# EAGLE design 0134-logic-level-shifter-x8 (EAGLE 9.6.2)
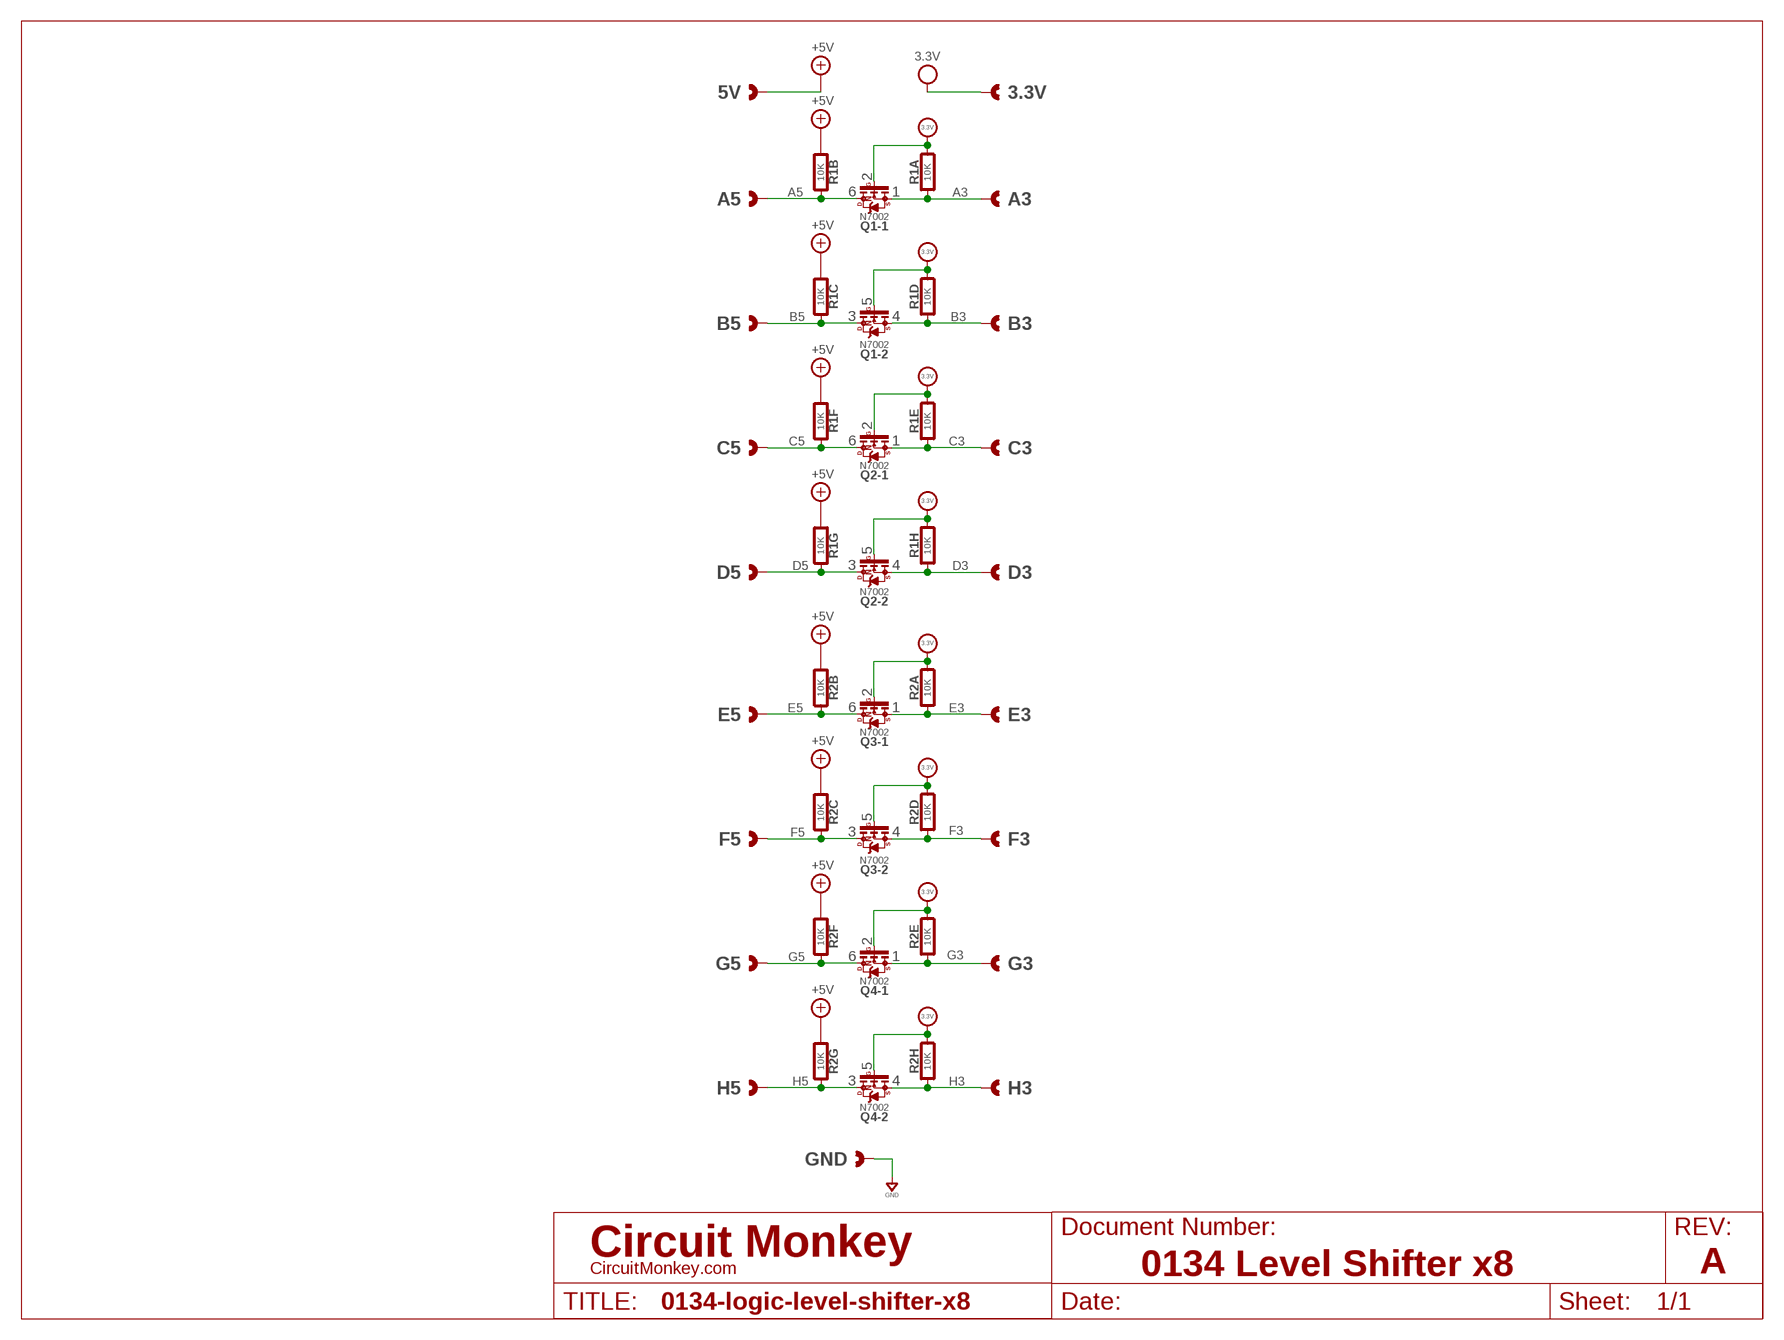
[diagram p0: schematic, sheet 1]
U$1 (LETTER_L-CIRCUITMONKEY): DOCUMENT_NUMBER: 0134 Level Shifter x8; REV: A

## Parts
3.3V  CAST-01X12.00MM  [CAST01-2.00MM]
5V  CAST-01X12.00MM  [CAST01-2.00MM]
A3  CAST-01X12.00MM  [CAST01-2.00MM]
A5  CAST-01X12.00MM  [CAST01-2.00MM]
B3  CAST-01X12.00MM  [CAST01-2.00MM]
B5  CAST-01X12.00MM  [CAST01-2.00MM]
C3  CAST-01X12.00MM  [CAST01-2.00MM]
C5  CAST-01X12.00MM  [CAST01-2.00MM]
D3  CAST-01X12.00MM  [CAST01-2.00MM]
D5  CAST-01X12.00MM  [CAST01-2.00MM]
E3  CAST-01X12.00MM  [CAST01-2.00MM]
E5  CAST-01X12.00MM  [CAST01-2.00MM]
F3  CAST-01X12.00MM  [CAST01-2.00MM]
F5  CAST-01X12.00MM  [CAST01-2.00MM]
G3  CAST-01X12.00MM  [CAST01-2.00MM]
G5  CAST-01X12.00MM  [CAST01-2.00MM]
GND  CAST-01X12.00MM  [CAST01-2.00MM]
H3  CAST-01X12.00MM  [CAST01-2.00MM]
H5  CAST-01X12.00MM  [CAST01-2.00MM]
Q1  N7002  N-FET_DUAL7002  [SOT-563]
Q2  N7002  N-FET_DUAL7002  [SOT-563]
Q3  N7002  N-FET_DUAL7002  [SOT-563]
Q4  N7002  N-FET_DUAL7002  [SOT-563]
R1  10K  RESNET_0402_INDIV_X8PAN  [RESNET_0402_X8]
R2  10K  RESNET_0402_INDIV_X8PAN  [RESNET_0402_X8]

## Nets
+3.3V: 3.3V.1 3.3V.P$1 3.3V.P$2 Q1.2(-1:G) Q1.5(-2:G) Q2.2(-1:G) Q2.5(-2:G) Q3.2(-1:G) Q3.5(-2:G) Q4.2(-1:G) Q4.5(-2:G) R1.1 R1.4 R1.5 R1.8 R2.1 R2.4 R2.5 R2.8 ; supply symbol labelled 3.3V
+5V: 5V.1 5V.P$1 5V.P$2 R1.10 R1.11 R1.14 R1.15 R2.10 R2.11 R2.14 R2.15
A3: A3.1 A3.P$1 A3.P$2 Q1.1(-1:S) R1.16
A5: A5.1 A5.P$1 A5.P$2 Q1.6(-1:D) R1.2
B3: B3.1 B3.P$1 B3.P$2 Q1.4(-2:S) R1.13
B5: B5.1 B5.P$1 B5.P$2 Q1.3(-2:D) R1.3
C3: C3.1 C3.P$1 C3.P$2 Q2.1(-1:S) R1.12
C5: C5.1 C5.P$1 C5.P$2 Q2.6(-1:D) R1.6
D3: D3.1 D3.P$1 D3.P$2 Q2.4(-2:S) R1.9
D5: D5.1 D5.P$1 D5.P$2 Q2.3(-2:D) R1.7
E3: E3.1 E3.P$1 E3.P$2 Q3.1(-1:S) R2.16
E5: E5.1 E5.P$1 E5.P$2 Q3.6(-1:D) R2.2
F3: F3.1 F3.P$1 F3.P$2 Q3.4(-2:S) R2.13
F5: F5.1 F5.P$1 F5.P$2 Q3.3(-2:D) R2.3
G3: G3.1 G3.P$1 G3.P$2 Q4.1(-1:S) R2.12
G5: G5.1 G5.P$1 G5.P$2 Q4.6(-1:D) R2.6
GND: GND.1 GND.P$1 GND.P$2
H3: H3.1 H3.P$1 H3.P$2 Q4.4(-2:S) R2.9
H5: H5.1 H5.P$1 H5.P$2 Q4.3(-2:D) R2.7

## Library data of the parts
3.3V 5V A3 A5 B3 B5 C3 C5 D3 D5 E3 E5 F3 F5 G3 G5 GND H3 H5 = con-headers:CAST-01X1: Castelated Edge Hole Pad
Q1-Q4 = transistor-fet:N-FET_DUAL: Dual FET; COST01: 0.25; COST100: 0.07; MFR: Toshiba; MPN: SSM6N7002BFE
R1 R2 = rlc:RESNET_0402_INDIV_X8: Resnet - Network Eight Individual Resistors.; COST01: 0.27; COST10: 0.17; COST100: 0.10; MFR: Panasonic; MPN: EXB-2HVxxx

## Board
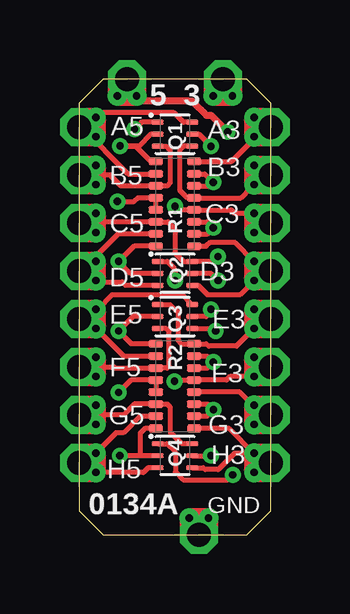
[diagram p1: board, top side]
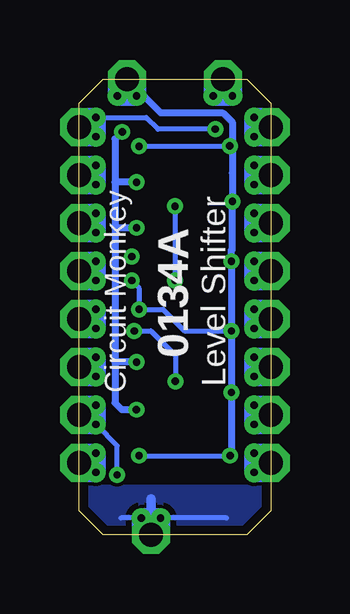
[diagram p2: board, bottom side, seen from below]

Size 8 x 19 mm. Coordinates in mm from the lower left corner, seen from the top.
Outline: 0,18 0,1 1,0 7,0 8,1 8,18 7,19 1,19 0,18
Copper layers (1*16): Top 0.0712mm / dielectric 0.657mm / Bottom 0.0712mm
Design rules "OSH-CircuitMonkey-thin": minimum track width 6mil, minimum drill 12mil, track to track 6mil, track to pad 6mil, pad to pad 6mil, via to via 6mil, smd to smd 6mil, copper to edge 15mil, drill to drill 6mil, minimum pad ring 7mil, minimum via ring 7mil, stop-mask expansion 3mil, vias tented up to drill 14mil, thermal gap 10mil

### Footprints (pad centres in the part's own frame; a part is rotated, then mirrored left to right if it is on the bottom)
CAST01-2.00MM = drill 1 pad 1.6 octagon: 1 0,0 | drill 0.305 pad 0.813: P$1 -0.7,0.4; P$2 -0.7,-0.4
SOT-563 = smd 0.2 x 0.5: 1 -0.5,-0.72; 2 0,-0.72; 3 0.5,-0.72; 4 0.5,0.72; 5 0,0.72; 6 -0.5,0.72
RESNET_0402_X8 = smd 0.6 x 0.325: 1 -0.8,1.765; 8 -0.8,-1.765; 9 0.8,-1.765; 16 0.8,1.765 | smd 0.6 x 0.3: 2 -0.8,1.25; 3 -0.8,0.75; 4 -0.8,0.25; 5 -0.8,-0.25; 6 -0.8,-0.75; 7 -0.8,-1.25; 10 0.8,-1.25; 11 0.8,-0.75; 12 0.8,-0.25; 13 0.8,0.25; 14 0.8,0.75; 15 0.8,1.25

### Placement (x,y rotation side)
3.3V  6,19 90 top
5V  2,19 90 top
A3  8,17 0 top
A5  0,17 180 top
B3  8,15 0 top
B5  0,15 180 top
C3  8,13 0 top
C5  0,13 180 top
D3  8,11 0 top
D5  0,11 180 top
E3  8,9 0 top
E5  0,9 180 top
F3  8,7 0 top
F5  0,7 180 top
G3  8,5 0 top
G5  0,5 180 top
GND  5,0 270 top
H3  8,3 0 top
H5  0,3 180 top
Q1  4,16.7 270 top
Q2  4,10.9 270 top
Q3  4,9.1 270 top
Q4  4,3.3 270 top
R1  4,13.8 0 top
R2  4,6.2 0 top

### Tracks (layer width: path | path; a pad name or v marks a point on that pad's centre or on a via)
+3.3V  (via drill 0.3)
  Top 0.2: Q1.2 2.98,16.7 2.49,16.21 v1.71,16.21 2.35,16.21 3,15.56 R1.1 | v1.6,13.9 2.3,13.9 2.45,14.05 R1.4 R1.5 | R2.5 R2.4 2.17,6.45 v1.65,5.93 | R1.8 2.3,12.04 1.67,11.41 v1.65,11.41 2.15,10.9 Q2.2 | Q4.5 v5.5,3.3 | v5.5,9.4 5.5,9.3 5.3,9.1 Q3.5 | Q2.5 5.5,10.9 v5.8,10.6 | v5.5,16.2 5,16.7 Q1.5 | Q4.2 2.55,3.3 | 2.55,3.3 v1.7,3.3 | R2.8 2.75,4.43 2.55,4.24 2.55,3.3 | R2.1 2.18,7.96 v1.65,8.5 2.25,9.1 Q3.2 | 3.3V.P$1 5.6,18.6 3.3V.1 6,18.7 3.3V.P$2
  Bottom 0.2: v5.5,3.3 v1.7,3.3 | v1.65,8.5 3.6,8.5 4.5,9.4 v5.5,9.4 5.5,10.3 v5.8,10.6 | v5.5,16.2 5.49,16.21 v1.71,16.21
  Bottom 0.3: v1.7,3.3 1.65,3.35 v1.65,5.93 v1.65,8.5 v1.65,11.41 1.65,11.86 1.61,11.89 1.61,13.89 v1.6,13.9 1.61,13.9 1.61,15.1 1.61,16.11 v1.71,16.21 1.61,16.31 1.61,17.21 2,17.6 4.6,17.6 3.3V.1
+5V  (via drill 0.3)
  Top 0.2: R2.15 5.35,7.45 v5.6,7.2 5.35,6.95 R2.14 | R2.11 5.38,5.45 v5.61,5.22 5.34,4.95 R2.10 | R1.10 5.35,12.55 v5.6,12.8 5.35,13.05 R1.11 | R1.14 5.45,14.55 v5.6,14.7 5.25,15.05 R1.15 | 5V.P$2 2.4,18.6 5V.1 1.6,18.6 5V.P$1
  Top 0.3: 5V.1 2,18.8 2.7,18.1 4.7,18.1 5.31,17.49 5.51,17.49 v6.2,16.8
  Bottom 0.3: v5.61,5.22 6.22,5.22 6.5,5.5 6.5,7.2 | v6.2,16.8 6.5,16.5 6.5,14.7 | 6.5,14.7 6.5,12.8 | 6.5,12.8 6.5,7.2 | v5.6,7.2 6.5,7.2 | v5.6,14.7 6.5,14.7 | v5.6,12.8 6.5,12.8
A3  (via drill 0.3)
  Top 0.2: R1.16 6.37,15.56 7.3,16.5 A3.P$2 | A3.P$2 7.7,17 A3.1 | Q1.1 2.6,17.2 v2.32,16.91 | A3.1 7.6,17.4 A3.P$1 | A3.1 7.6,16.6 A3.P$2
  Bottom 0.2: A3.1 7.7,17 A3.P$1 5.2,17.4 4.71,16.91 v2.32,16.91
A5
  Top 0.2: R1.2 2.05,15.05 0.1,17 A5.1 | Q1.6 4.36,17.2 3.96,17.6 0.6,17.6 A5.1 | A5.1 0.3,17 A5.P$1 | A5.1 0.4,17.4 A5.P$2
B3
  Top 0.2: B3.P$2 7.15,14.45 | 7.15,14.45 6.75,14.05 R1.13 4.53,14.05 4.2,14.38 4.2,16.04 4.35,16.2 Q1.4 | B3.P$1 7.6,15.4 B3.1 7.45,14.45 7.15,14.45
B5
  Top 0.2: B5.1 1.3,15 1.75,14.55 R1.3 3.67,14.55 3.8,14.68 3.8,16.04 3.65,16.2 Q1.3 | B5.1 0.4,15.4 B5.P$2 | B5.1 0.4,14.6 B5.P$1
C3  (via drill 0.3)
  Top 0.2: Q2.1 3.68,11.4 4,11.08 v4,10.6 | v4,13.7 4.15,13.55 R1.12 6.35,13.55 6.5,13.4 C3.P$1 7.6,13.4 C3.1 7.6,12.6 C3.P$2
  Bottom 0.2: v4,13.7 v4,10.6
C5  (via drill 0.3)
  Top 0.2: v5.8,11.6 5.65,11.45 5.57,11.45 5.52,11.4 Q2.6 4.35,11.4 4,11.76 4,12.75 3.7,13.05 R1.6 0.85,13.05 0.8,13.1 0.1,13.1 C5.1 | C5.1 0.4,13.4 C5.P$2 | C5.1 0.4,12.6 C5.P$1
D3
  Top 0.2: R1.9 5.3,12.04 5.45,12.19 6.51,12.19 D3.P$1 7.6,11.4 D3.1 7.6,10.6 D3.P$2 6.7,10 5.38,10 4.98,10.4 Q2.4
D5
  Top 0.2: R1.7 1.63,12.55 0.7,11.62 D5.P$2 0.4,11.4 D5.1 | Q2.3 1.95,10.4 1.8,10.55 0.45,10.55 D5.1 | D5.1 0.4,10.6 D5.P$1
E3
  Top 0.2: E3.P$2 7.15,8.45 | 7.15,8.45 6.57,7.87 5.4,7.87 5.3,7.96 R2.16 4.27,7.96 4.12,8.12 4.12,9.28 3.8,9.6 Q3.1 | E3.P$1 7.6,9.4 E3.1 7.45,8.45 7.15,8.45
E5
  Top 0.2: Q3.6 4.31,10.01 1.38,10.01 0.77,9.4 E5.P$2 0.3,9 | R2.2 1.85,7.45 E5.P$1 0.3,9 | E5.1 0.3,9
F3  (via drill 0.3)
  Top 0.2: Q3.4 5.6,8.6 v5.7,8.5 | v3.98,6.4 4.03,6.45 R2.13 6.15,6.45 6.3,6.6 F3.P$2 7.6,6.6 F3.1 7.6,7.4 F3.P$1
  Bottom 0.2: v5.7,8.5 5,8.5 3.98,7.48 v3.98,6.4
F5
  Top 0.2: Q3.3 3.65,8.6 3.75,8.49 3.75,7.03 3.67,6.95 R2.3 1.5,6.95 1.45,7 F5.1 0.3,7 | 0.3,7 F5.P$2 | 0.3,7 F5.P$1
G3  (via drill 0.3)
  Top 0.2: G3.1 7.65,5 6.7,5.95 R2.12 | Q4.1 3.66,3.8 4.02,3.45 4.02,2.62 4.34,2.3 6.21,2.3 v6.41,2.5 | G3.1 7.6,4.6 G3.P$2 | G3.1 7.6,5.4 G3.P$1
  Bottom 0.2: v6.41,2.5 6.41,3.71 G3.P$2
G5
  Top 0.2: Q4.6 4.3,3.8 3.8,4.3 3.8,5.32 3.67,5.45 R2.6 2.3,5.45 1.85,5 G5.1 0.3,5 | 0.3,5 G5.P$2 | 0.3,5 G5.P$1
GND
  Top 0.2: 5,0.3 GND.P$1 | GND.1 5,0.3 | 5,0.3 GND.P$2
  Bottom 0.2: 1.85,0.7 6.25,0.7
  Bottom 0.4: GND.1 5,1.5
  pour Bottom: 0,0 8,0 8,2 0,2
H3
  Top 0.2: H3.P$1 6.26,4.43 R2.9 | Q4.4 5.18,2.8 5.26,2.72 5.81,2.72 6.49,3.4 H3.P$1 | H3.P$2 7.6,2.6 H3.1 7.6,3.4 H3.P$1
H5
  Top 0.2: R2.7 2.55,4.95 1.85,4.25 1.53,4.25 0.28,3 H5.1 | Q4.3 2.88,2.8 2.68,2.6 0.8,2.6 0.4,3 H5.1 | H5.1 0.4,2.6 H5.P$1 | H5.1 0.4,3.4 H5.P$2

### Text on the board
tPlace: 5 3 | 0134A | GND
bPlace: Level Shifter | 0134A | Circuit Monkey